# EAGLE schematic RaspiLabBoard_old (EAGLE 9.3.1)
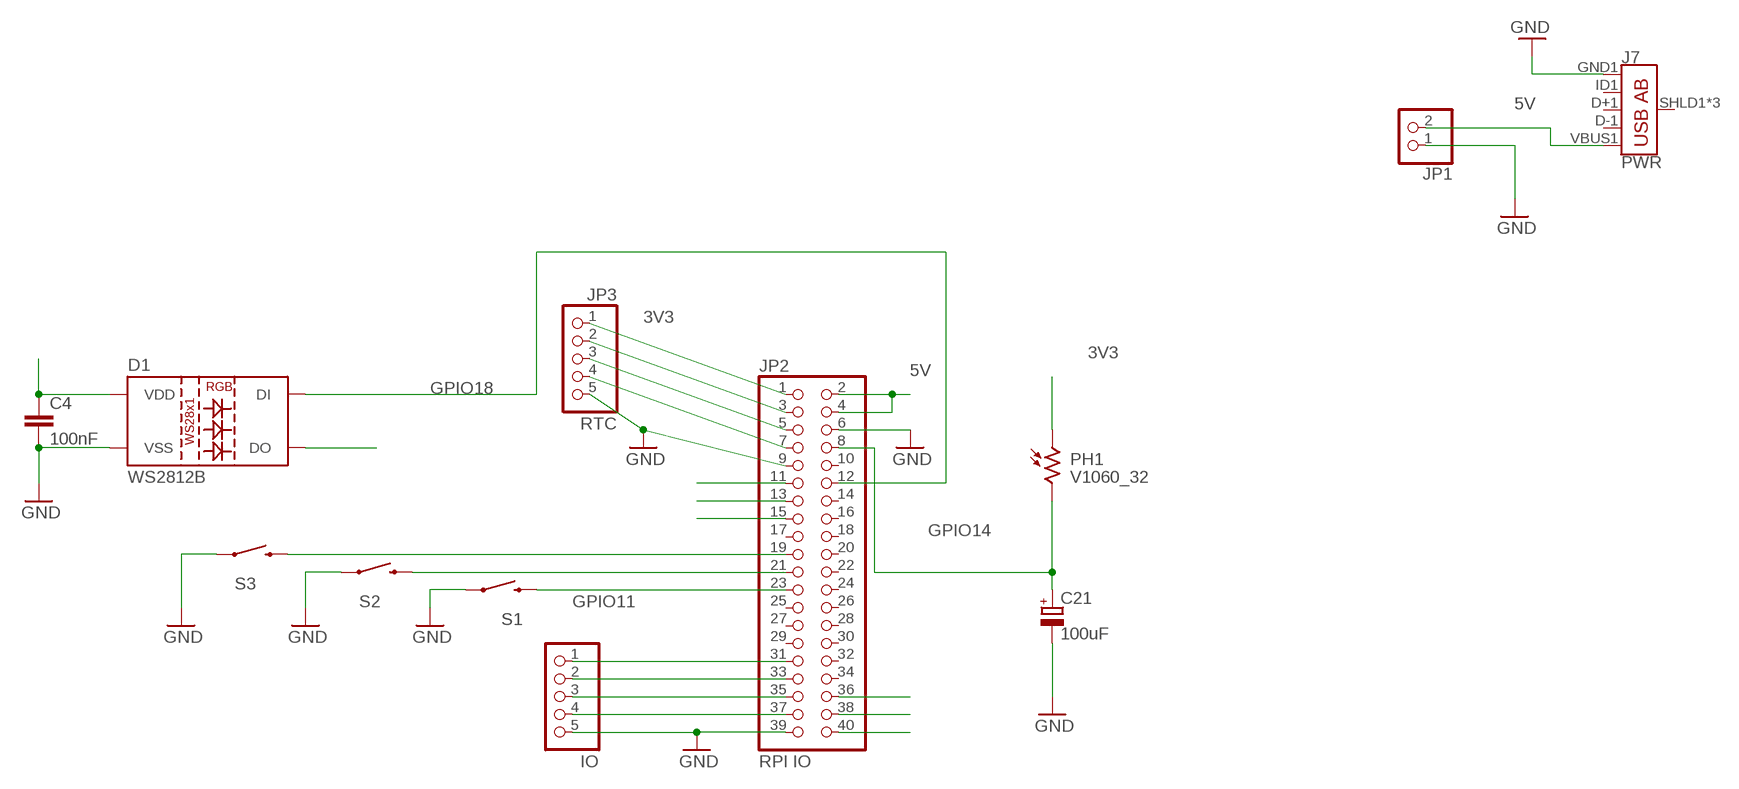
[diagram p0: schematic, sheet 1]

## Parts
C4  100nF  CAP0805  [0805]
C21  100uF  CPOL-EUE5-10.5  [E5-10,5]
D1  WS2812B  [WS2812B]
J7  PWR  USB_AB_SMT  [USB-AB-MICRO-SMD]
JP1  PINHD-1X2  [1X02]
JP2  RPI IO  PINHD-2X20  [2X20]
JP3  RTC  PINHD-1X5  [1X05]
JP4  IO  PINHD-1X5  [1X05]
PH1  V1060_32  [TO-5_V10]
S1  SWITCH  SWITCH-MOMENTARY-2SMD-1101NE  [TACTILE-SWITCH-1101NE]
S2  SWITCH  SWITCH-MOMENTARY-2SMD-1101NE  [TACTILE-SWITCH-1101NE]
S3  SWITCH  SWITCH-MOMENTARY-2SMD-1101NE  [TACTILE-SWITCH-1101NE]

## Nets
3V3: JP2.1 JP3.1 PH1.1
5V: C4.1 D1.1(VDD) J7.VBUS1(VBUS) JP1.2 JP2.2 JP2.4
GND: C4.2 C21.- D1.3(VSS) J7.GND1(GND) JP1.1 JP2.6 JP2.9 JP2.39 JP3.5 JP4.5 S1.1 S2.1 S3.1
GPIO6: JP2.31 JP4.1
GPIO9: JP2.21 S2.2
GPIO10: JP2.19 S3.2
GPIO11: JP2.23 S1.2
GPIO13: JP2.33 JP4.2
GPIO14: C21.+ JP2.8 PH1.2
GPIO16: JP2.36
GPIO17: JP2.11
GPIO18: D1.4(DI) JP2.12
GPIO19: JP2.35 JP4.3
GPIO20: JP2.38
GPIO21: JP2.40
GPIO22: JP2.15
GPIO26: JP2.37 JP4.4
GPIO27: JP2.13
N$2: JP2.3 JP3.2
N$3: JP2.5 JP3.3
N$4: JP2.7 JP3.4
N$15: D1.2(DO)
Unconnected: J7.D+1(D+) J7.D-1(D-) J7.ID1(USBID) J7.SHLD1(SHIELD) J7.SHLD2(SHIELD) J7.SHLD3(SHIELD) JP2.10 JP2.14 JP2.16 JP2.17 JP2.18 JP2.20 JP2.22 JP2.24 JP2.25 JP2.26 JP2.27 JP2.28 JP2.29 JP2.30 JP2.32 JP2.34

## Library data of the parts
C4 = SparkFun-Passives:CAP: Capacitor Standard 0603 ceramic capacitor, and 0.1" leaded capacitor.
C21 = rcl:CPOL-EU: POLARIZED CAPACITOR, European symbol; SPICEPREFIX: C
D1 = SparkFun-LED:WS2812B: WS2812B SMD addressable RGB LED 5x5mm SMD LED with built-in controller IC. Color: Red/Green/Blue mC Rating: RGB: 390, 660, 180 mcd Forward Voltage: RGB: 2.0, 3.0, 3.0 V Packages:WS2812B SparkFun Products: Blynk Board - ESP8266 <https://www.sparkfun.com/products/13794>; PROD_ID: DIO-12503
J7 = SparkFun-Connectors:USB_AB: USB Type AB Micro Connector OTG-compatible. 5 pins, 3 shield pins SparkFun Products: IOIO-OTG <https://www.sparkfun.com/products/13613> SparkFun SAMD21 Mini Breakout <https://www.sparkfun.com/products/13664>; PROD_ID: CONN-11794
JP1 = pinhead:PINHD-1X2: PIN HEADER
JP2 = pinhead:PINHD-2X20: PIN HEADER
JP3 JP4 = pinhead:PINHD-1X5: PIN HEADER
PH1 = photo-elements:?1060*: Sensor Street Light control Source: http://optoelectronics.perkinelmer.com/content/Datasheets/DTS_PhotocellsB1060.pdf
S1-S3 = SparkFun-Electromechanical:SWITCH-MOMENTARY-2: Various NO switches- pushbuttons, reed, etc; PROD_ID: SWCH-00815